# EAGLE design LWBoard (EAGLE 5.10)
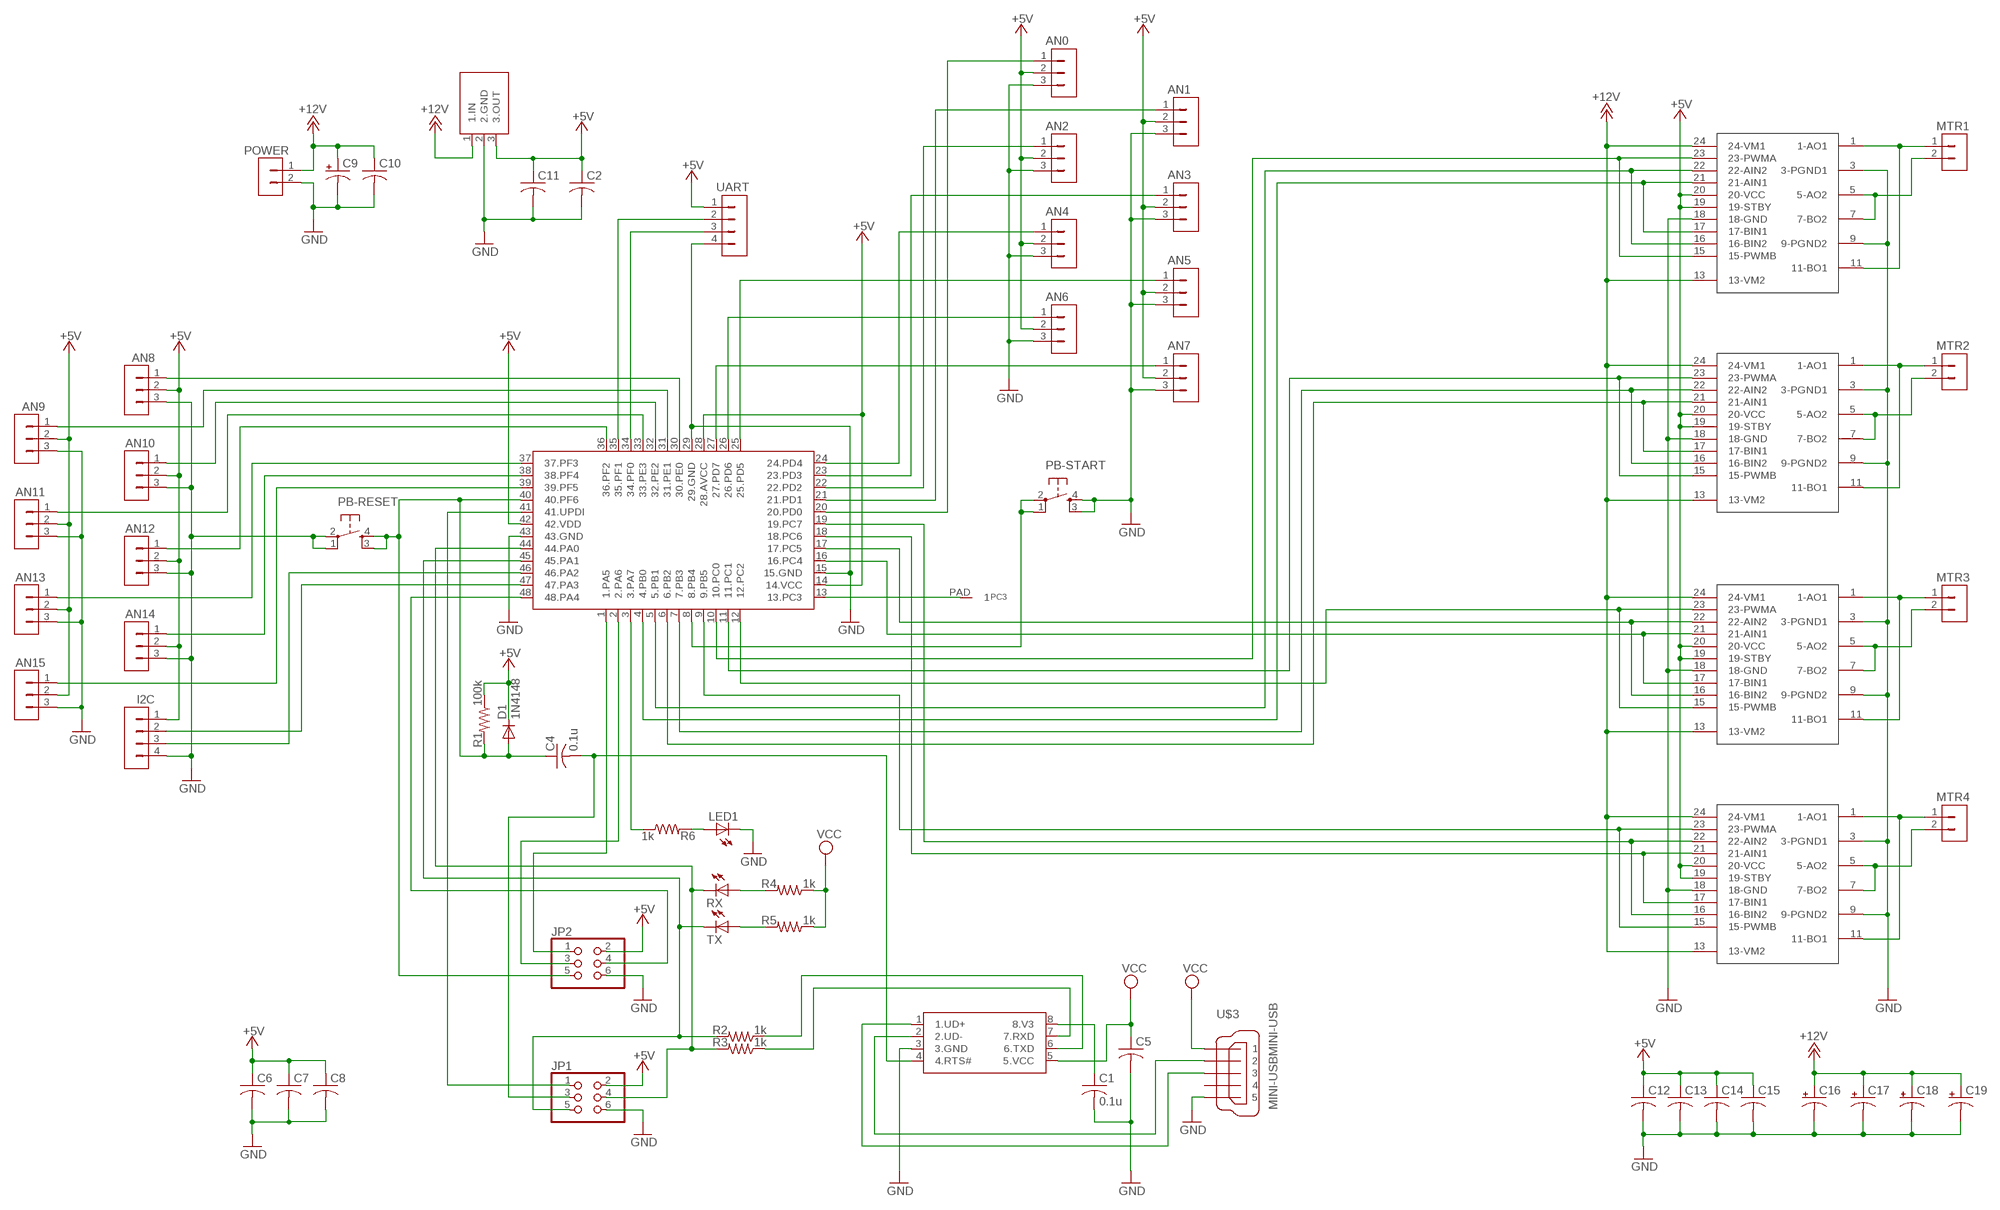
[diagram p0: schematic, sheet 1]

## Parts
AN0  XH3PDEFAULT  [XH3P]
AN1  XH3PDEFAULT  [XH3P]
AN2  XH3PDEFAULT  [XH3P]
AN3  XH3PDEFAULT  [XH3P]
AN4  XH3PDEFAULT  [XH3P]
AN5  XH3PDEFAULT  [XH3P]
AN6  XH3PDEFAULT  [XH3P]
AN7  XH3PDEFAULT  [XH3P]
AN8  XH3PDEFAULT  [XH3P]
AN9  XH3PDEFAULT  [XH3P]
AN10  XH3PDEFAULT  [XH3P]
AN11  XH3PDEFAULT  [XH3P]
AN12  XH3PDEFAULT  [XH3P]
AN13  XH3PDEFAULT  [XH3P]
AN14  XH3PDEFAULT  [XH3P]
AN15  XH3PDEFAULT  [XH3P]
C1  0.1u  C-USC0603  [C0603]
C2  C-USC1206  [C1206]
C4  0.1u  C-USC0603  [C0603]
C5  C-USC0603  [C0603]
C6  C-USC0603  [C0603]
C7  C-USC0603  [C0603]
C8  C-USC0603  [C0603]
C9  CPOL-USE5-10.5  [E5-10,5]
C10  C-USC0603  [C0603]
C11  C-USC0603  [C0603]
C12  C-USC0603  [C0603]
C13  C-USC0603  [C0603]
C14  C-USC0603  [C0603]
C15  C-USC0603  [C0603]
C16  CPOL-USE1.8-4  [E1,8-4]
C17  CPOL-USE1.8-4  [E1,8-4]
C18  CPOL-USE1.8-4  [E1,8-4]
C19  CPOL-USE1.8-4  [E1,8-4]
D1  1N4148  DIODE-SOD123  [SOD123]
I2C  XH4PDEFAULT  [XH4P]
IC1  MEGA4809  ATMEGA4809  [TQFP48]
IC5  TB6612FNG  TB6612-BB2  [TB6612-B2]
IC6  TB6612FNG  TB6612-BB2  [TB6612-B2]
IC7  TB6612FNG  TB6612-BB2  [TB6612-B2]
IC8  TB6612FNG  TB6612-BB2  [TB6612-B2]
JP1  PINHD-2X3  [2X03]
JP2  PINHD-2X3  [2X03]
LED1  LEDCHIP-LED0603  [CHIP-LED0603]
MTR1  XH2PDEFAULT  [XH2P]
MTR2  XH2PDEFAULT  [XH2P]
MTR3  XH2PDEFAULT  [XH2P]
MTR4  XH2PDEFAULT  [XH2P]
PB-RESET  TS20.2X0.35_IN  [TS2-SM2X3.5_IN]
PB-START  TS20.2X0.35_IN  [TS2-SM2X3.5_IN]
PC3  1-PIN0.9MM  [1-PIN_0.9MM]
POWER  XH2PDEFAULT  [XH2P]
R1  100k  R-US_R0603  [R0603]
R2  1k  R-US_R0603  [R0603]
R3  1k  R-US_R0603  [R0603]
R4  1k  R-US_R0603  [R0603]
R5  1k  R-US_R0603  [R0603]
R6  1k  R-US_R0603  [R0603]
RX  LEDCHIP-LED0603  [CHIP-LED0603]
TX  LEDCHIP-LED0603  [CHIP-LED0603]
U$2  CH340N  [SOP8]
U$3  MINI-USBMINI-USB  [MINI-USB]
U$4  NJM7800S  [TO252]
UART  XH4PDEFAULT  [XH4P]

## Nets
+5V: AN0.2 AN1.2 AN2.2 AN3.2 AN4.2 AN5.2 AN6.2 AN7.2 AN8.2 AN9.2 AN10.2 AN11.2 AN12.2 AN13.2 AN14.2 AN15.2 C2.1 C6.1 C7.1 C8.1 C11.1 C12.1 C13.1 C14.1 C15.1 D1.C I2C.1 IC1.14(14.VCC) IC1.28(28.AVCC) IC1.42(42.VDD) IC5.19(19-STBY) IC5.20(20-VCC) IC6.19(19-STBY) IC6.20(20-VCC) IC7.19(19-STBY) IC7.20(20-VCC) IC8.19(19-STBY) IC8.20(20-VCC) JP1.2 JP2.2 R1.1 U$4.3(3.OUT) UART.1
+12V: C9.+ C10.1 C16.+ C17.+ C18.+ C19.+ IC5.13(13-VM2) IC5.24(24-VM1) IC6.13(13-VM2) IC6.24(24-VM1) IC7.13(13-VM2) IC7.24(24-VM1) IC8.13(13-VM2) IC8.24(24-VM1) POWER.1 U$4.1(1.IN)
GND: AN0.3 AN1.3 AN2.3 AN3.3 AN4.3 AN5.3 AN6.3 AN7.3 AN8.3 AN9.3 AN10.3 AN11.3 AN12.3 AN13.3 AN14.3 AN15.3 C1.2 C2.2 C5.2 C6.2 C7.2 C8.2 C9.- C10.2 C11.2 C12.2 C13.2 C14.2 C15.2 C16.- C17.- C18.- C19.- I2C.4 IC1.15(15.GND) IC1.29(29.GND) IC1.43(43.GND) IC5.3(3-PGND1) IC5.9(9-PGND2) IC5.18(18-GND) IC6.3(3-PGND1) IC6.9(9-PGND2) IC6.18(18-GND) IC7.3(3-PGND1) IC7.9(9-PGND2) IC7.18(18-GND) IC8.3(3-PGND1) IC8.9(9-PGND2) IC8.18(18-GND) JP1.6 JP2.6 LED1.C PB-RESET.1 PB-RESET.2(P) PB-START.3(S1) PB-START.4(S) POWER.2 U$2.3(3.GND) U$3.5 U$4.2(2.GND) UART.4
N$1: C4.1 D1.A IC1.40(40.PF6) JP2.5 PB-RESET.3(S1) PB-RESET.4(S) R1.2
N$4: IC1.41(41.UPDI) JP1.1
N$5: AN0.1 IC1.20(20.PD0)
N$6: AN1.1 IC1.21(21.PD1)
N$7: R4.2 RX.A
N$8: R2.1 U$2.6(6.TXD)
N$9: R3.1 U$2.7(7.RXD)
N$10: IC1.45(45.PA1) JP1.5 R2.2 TX.C
N$11: IC1.44(44.PA0) JP1.4 R3.2 RX.C
N$12: C1.1 U$2.8(8.V3)
N$13: C4.2 JP1.3 U$2.4(4.RTS#)
N$14: R5.2 TX.A
N$15: U$2.2(2.UD-) U$3.2
N$16: U$2.1(1.UD+) U$3.3
N$17: AN2.1 IC1.22(22.PD2)
N$18: LED1.A R6.2
N$19: IC1.3(3.PA7) R6.1
N$20: AN3.1 IC1.23(23.PD3)
N$21: AN4.1 IC1.24(24.PD4)
N$22: AN5.1 IC1.25(25.PD5)
N$23: AN6.1 IC1.26(26.PD6)
N$24: AN7.1 IC1.27(27.PD7)
N$25: AN8.1 IC1.30(30.PE0)
N$26: AN9.1 IC1.31(31.PE1)
N$27: AN10.1 IC1.32(32.PE2)
N$28: AN11.1 IC1.33(33.PE3)
N$29: AN12.1 IC1.36(36.PF2)
N$30: AN13.1 IC1.37(37.PF3)
N$31: AN14.1 IC1.38(38.PF4)
N$32: IC1.13(13.PC3) PC3.PAD
N$33: IC1.4(4.PB0) IC5.17(17-BIN1) IC5.21(21-AIN1)
N$34: I2C.2 IC1.47(47.PA3)
N$35: I2C.3 IC1.46(46.PA2)
N$36: IC5.5(5-AO2) IC5.7(7-BO2) MTR1.2
N$38: IC5.1(1-AO1) IC5.11(11-BO1) MTR1.1
N$39: IC1.10(10.PC0) IC5.15(15-PWMB) IC5.23(23-PWMA)
N$40: IC1.5(5.PB1) IC5.16(16-BIN2) IC5.22(22-AIN2)
N$41: IC1.11(11.PC1) IC6.15(15-PWMB) IC6.23(23-PWMA)
N$42: IC1.7(7.PB3) IC6.16(16-BIN2) IC6.22(22-AIN2)
N$43: IC1.6(6.PB2) IC6.17(17-BIN1) IC6.21(21-AIN1)
N$45: AN15.1 IC1.39(39.PF5)
N$46: IC6.5(5-AO2) IC6.7(7-BO2) MTR2.2
N$47: IC1.8(8.PB4) PB-START.1 PB-START.2(P)
N$48: IC6.1(1-AO1) IC6.11(11-BO1) MTR2.1
N$49: IC1.12(12.PC2) IC7.15(15-PWMB) IC7.23(23-PWMA)
N$50: IC1.17(17.PC5) IC7.16(16-BIN2) IC7.22(22-AIN2)
N$51: IC1.16(16.PC4) IC7.17(17-BIN1) IC7.21(21-AIN1)
N$53: IC1.34(34.PF0) UART.3
N$54: IC7.5(5-AO2) IC7.7(7-BO2) MTR3.2
N$55: IC1.35(35.PF1) UART.2
N$56: IC7.1(1-AO1) IC7.11(11-BO1) MTR3.1
N$57: IC1.9(9.PB5) IC8.15(15-PWMB) IC8.23(23-PWMA)
N$58: IC1.19(19.PC7) IC8.16(16-BIN2) IC8.22(22-AIN2)
N$59: IC1.18(18.PC6) IC8.17(17-BIN1) IC8.21(21-AIN1)
N$62: IC8.5(5-AO2) IC8.7(7-BO2) MTR4.2
N$64: IC8.1(1-AO1) IC8.11(11-BO1) MTR4.1
N$65: IC1.48(48.PA4) JP2.4
N$66: IC1.1(1.PA5) JP2.1
N$67: IC1.2(2.PA6) JP2.3
VCC: C5.1 R4.1 R5.1 U$2.5(5.VCC) U$3.1
Unconnected: U$3.4

## Library data of the parts
AN0 AN1-AN15 = 0-User:XH3P
C1 C2 C4-C8 C10-C15 = rcl:C-US: CAPACITOR, American symbol
C9 C16-C19 = rcl:CPOL-US: POLARIZED CAPACITOR, American symbol
D1 = diode:DIODE-: DIODE
I2C UART = 0-User:XH4P
IC1 = 0-User:ATMEGA4809
IC5-IC8 = 1-MotorDriver:TB6612-B
JP1 JP2 = pinhead:PINHD-2X3: PIN HEADER
LED1 RX TX = led:LED: LED OSRAM: - CHIPLED LG R971, LG N971, LY N971, LG Q971, LY Q971, LO R971, LY R971 LH N974, LH R974 LS Q976, LO Q976, LY Q976 LO Q996 - Hyper CHIPLED LW Q18S LB Q993, LB Q99A, LB R99A - SideLED LS A670, LO A670, LY A670, LG A670, LP A670 LB A673, LV A673, LT A673, LW A673 LH A674 LY A675 LS A676, LA A676, LO A676, LY A676, LW A676 LS A679, LY A679, LG A679 - Hyper Micro SIDELED® LS Y876, LA Y876, LO Y876, LY Y876 LT Y87S - SmartLED LW L88C, LW L88S LB L89C, LB L89S, LG L890 LS L89K, LO L89K, LY L89K LS L896, LA L896, LO L896, LY L896 - TOPLED LS T670, LO T670, LY T670, LG T670, LP T670 LSG T670, LSP T670, LSY T670, LOP T670, LYG T670 LG T671, LOG T671, LSG T671 LB T673, LV T673, LT T673, LW T673 LH T674 LS T676, LA T676, LO T676, LY T676, LB T676, LH T676, LSB T676, LW T676 LB T67C, LV T67C, LT T67C, LS T67K, LO T67K, LY T67K, LW E67C LS E67B, LA E67B, LO E67B, LY E67B, LB E67C, LV E67C, LT E67C LW T67C LS T679, LY T679, LG T679 LS T770, LO T770, LY T770, LG T770, LP T770 LB T773, LV T773, LT T773, LW T773 LH T774 LS E675, LA E675, LY E675, LS T675 LS T776, LA T776, LO T776, LY T776, LB T776 LHGB T686 LT T68C, LB T68C - Hyper Mini TOPLED® LB M676 - Mini TOPLED Santana® LG M470 LS M47K, LO M47K, LY M47K Source: http://www.osram.convergy.de LUXEON: - LUMILED® LXK2-PW12-R00, LXK2-PW12-S00, LXK2-PW14-U00, LXK2-PW14-V00 LXK2-PM12-R00, LXK2-PM12-S00, LXK2-PM14-U00 LXK2-PE12-Q00, LXK2-PE12-R00, LXK2-PE12-S00, LXK2-PE14-T00, LXK2-PE14-U00 LXK2-PB12-K00, LXK2-PB12-L00, LXK2-PB12-M00, LXK2-PB14-N00, LXK2-PB14-P00, LXK2-PB14-Q00 LXK2-PR12-L00, LXK2-PR12-M00, LXK2-PR14-Q00, LXK2-PR14-R00 LXK2-PD12-Q00, LXK2-PD12-R00, LXK2-PD12-S00 LXK2-PH12-R00, LXK2-PH12-S00 LXK2-PL12-P00, LXK2-PL12-Q00, LXK2-PL12-R00 Source: www.luxeon.com KINGBRIGHT: KA-3528ASYC Source: www.kingbright.com
MTR1-MTR4 POWER = 0-User:XH2P
PB-RESET PB-START = 0-User:TS2
PC3 = 0-User:1-PIN
R1-R6 = rcl:R-US_: RESISTOR, American symbol
U$2 = 0-User:CH340N
U$3 = 0-User:MINI-USB
U$4 = 0-User:NJM7800S

## Board
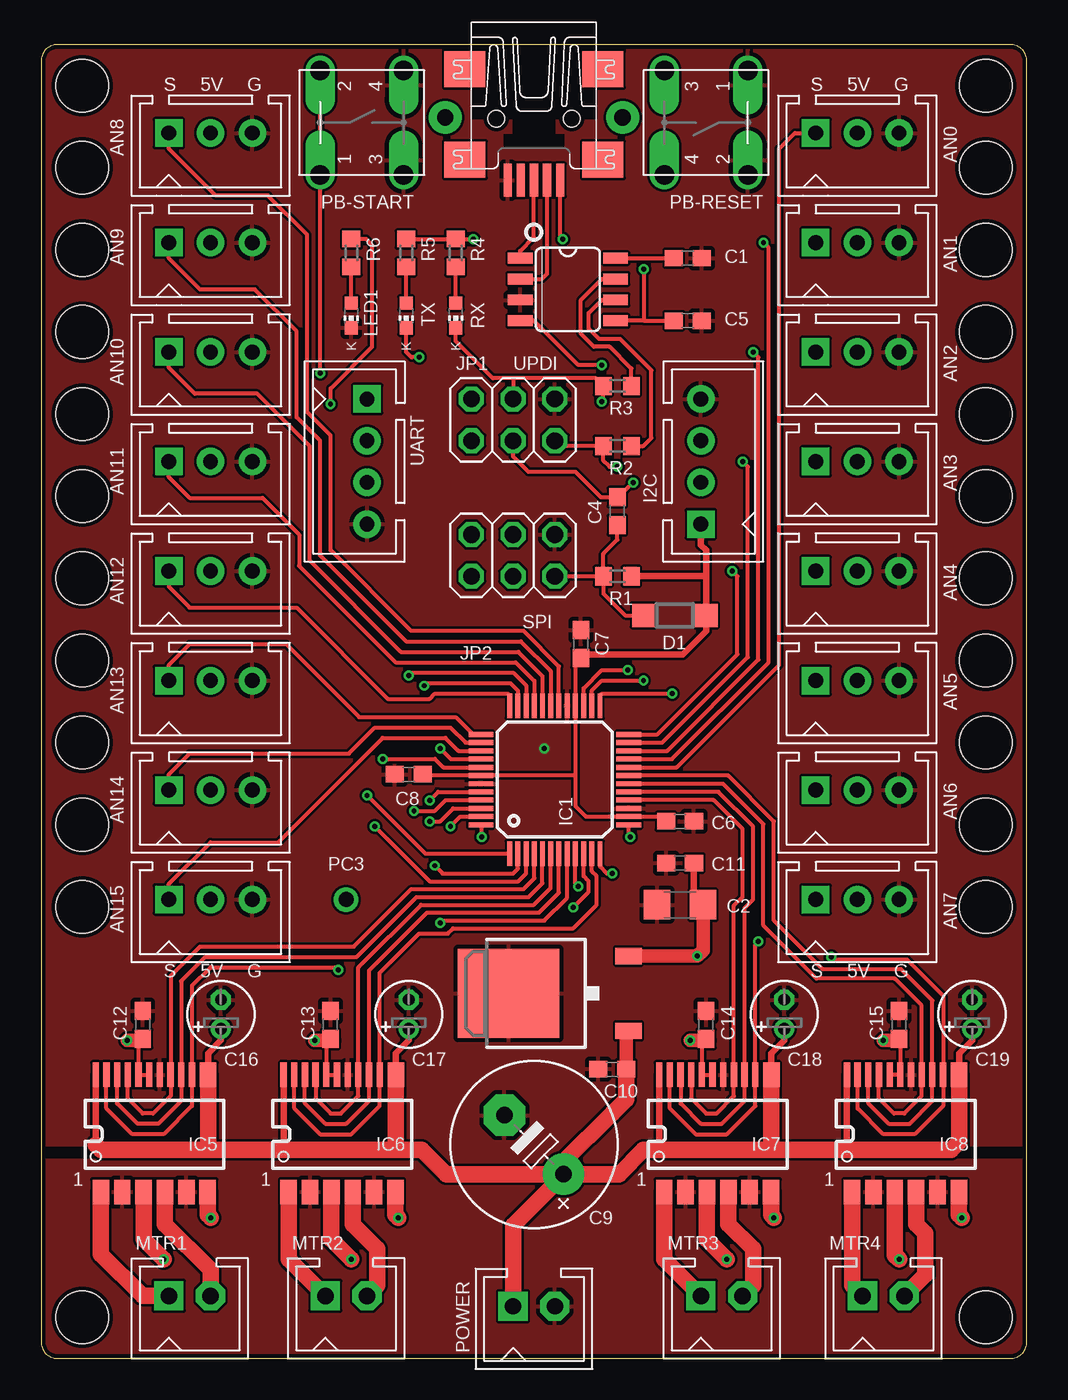
[diagram p1: board, top side]
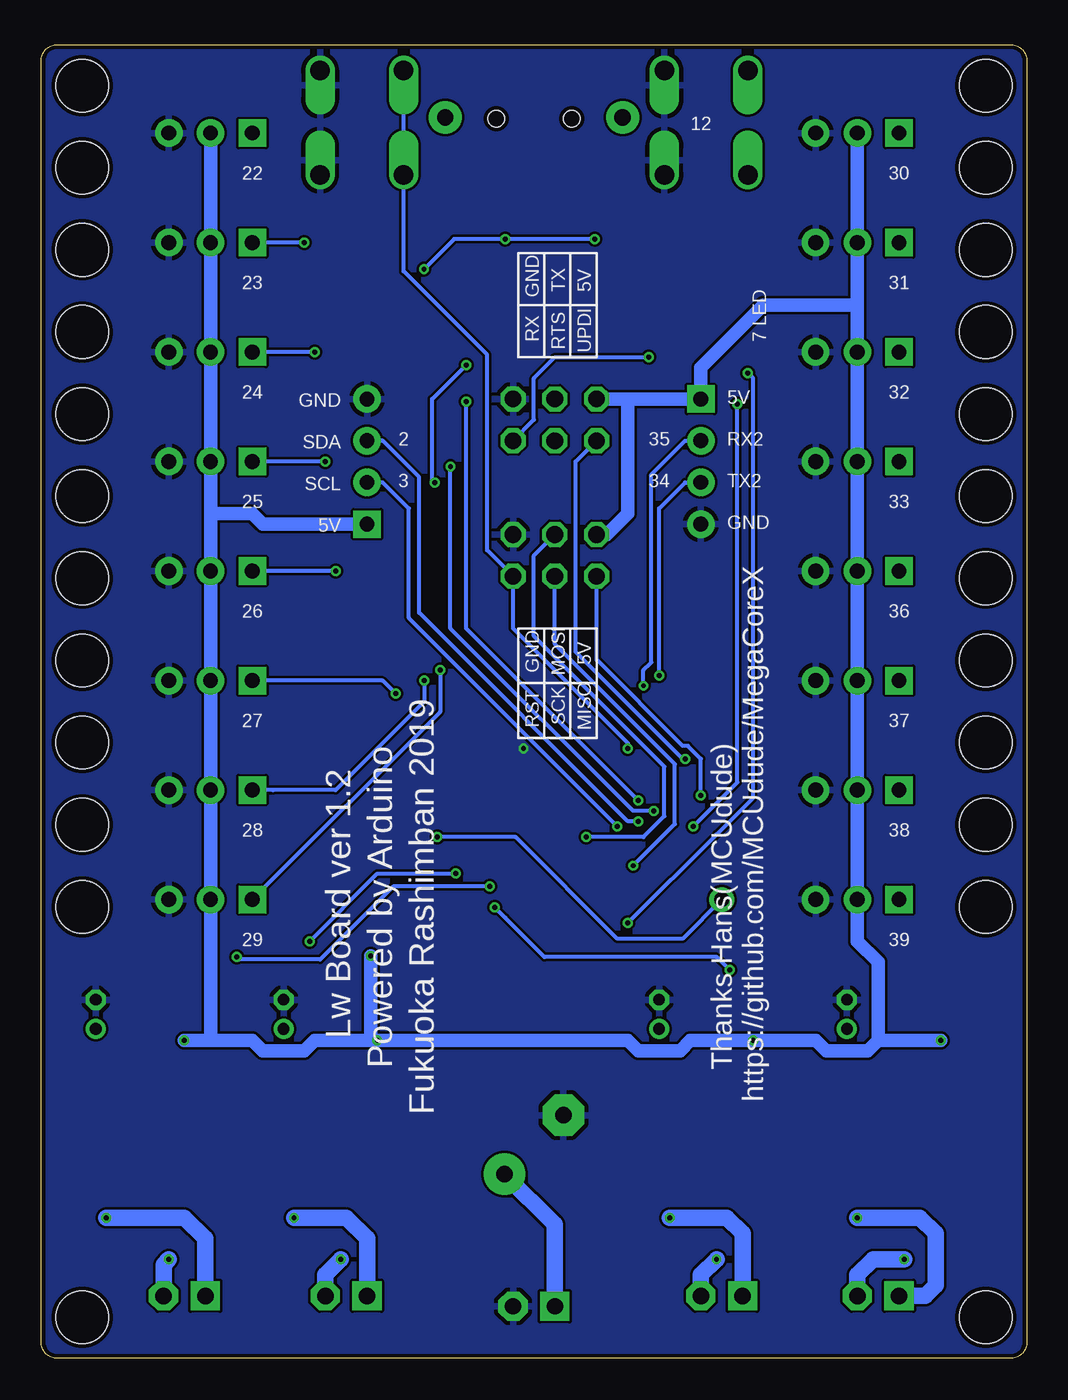
[diagram p2: board, bottom side, seen from below]

Size 60 x 80 mm. Coordinates in mm from the lower left corner, seen from the top.
Outline: 59,0 arc90 60,1 60,79 arc90 59,80 1,80 arc90 0,79 0,1 arc90 1,0 59,0
Copper layers (1*16): Top 0.035mm / dielectric 1.5mm / Bottom 0.035mm
Design rules "SeeedStudio_2layer_DRU_no_angle_20140221 *": minimum track width 6mil, minimum drill 11mil, track to track 6mil, track to pad 6mil, pad to pad 6mil, via to via 6mil, smd to smd 0mil, copper to edge 10mil, drill to drill 10mil, minimum pad ring 10mil, minimum via ring 6mil, stop-mask expansion 2mil, vias tented up to drill 100mil, thermal gap 10mil
Holes 3.2 mm at 2.5,77.5 2.5,72.5 2.5,67.5 2.5,62.5 2.5,57.5 2.5,52.5 2.5,47.5 2.5,42.5 2.5,37.5 2.5,32.5 2.5,27.5 2.5,2.5 57.5,77.5 57.5,72.5 57.5,67.5 57.5,62.5 57.5,57.5 57.5,52.5 57.5,47.5 57.5,42.5 57.5,37.5 57.5,32.5 57.5,27.5 57.5,2.5

### Footprints (pad centres in the part's own frame; a part is rotated, then mirrored left to right if it is on the bottom)
XH3P = drill 0.9 pad 1.676 square: 1 0,2.54 | drill 0.9 pad 1.676 round: 2 0,0; 3 0,-2.54
C0603 = smd 1.1 x 1: 1 -0.85,0; 2 0.85,0
C1206 = smd 1.6 x 1.8: 1 -1.4,0; 2 1.4,0
E5-10,5 = drill 1.016 pad 2.54 round: + -2.54,0 | drill 1.016 pad 2.54 octagon: - 2.54,0
E1,8-4 = drill 0.711 pad 1.168 round: + -0.889,0 | drill 0.711 pad 1.168 octagon: - 0.889,0
SOD123 = smd 1.4 x 1.4: A 1.9,0; C -1.9,0
XH4P = drill 0.9 pad 1.676 square: 1 0,0 | drill 0.9 pad 1.676 round: 2 0,2.54; 3 0,5.08; 4 0,7.62
TQFP48 = smd 1.5 x 0.3: 1 -4.5,2.75; 2 -4.5,2.25; 3 -4.5,1.75; 4 -4.5,1.25; 5 -4.5,0.75; 6 -4.5,0.25; 7 -4.5,-0.25; 8 -4.5,-0.75; 9 -4.5,-1.25; 10 -4.5,-1.75; 11 -4.5,-2.25; 12 -4.5,-2.75; 25 4.5,-2.75; 26 4.5,-2.25; 27 4.5,-1.75; 28 4.5,-1.25; 29 4.5,-0.75; 30 4.5,-0.25; 31 4.5,0.25; 32 4.5,0.75; 33 4.5,1.25; 34 4.5,1.75; 35 4.5,2.25; 36 4.5,2.75 | smd 0.3 x 1.5: 13 -2.75,-4.5; 14 -2.25,-4.5; 15 -1.75,-4.5; 16 -1.25,-4.5; 17 -0.75,-4.5; 18 -0.25,-4.5; 19 0.25,-4.5; 20 0.75,-4.5; 21 1.25,-4.5; 22 1.75,-4.5; 23 2.25,-4.5; 24 2.75,-4.5; 37 2.75,4.5; 38 2.25,4.5; 39 1.75,4.5; 40 1.25,4.5; 41 0.75,4.5; 42 0.25,4.5; 43 -0.25,4.5; 44 -0.75,4.5; 45 -1.25,4.5; 46 -1.75,4.5; 47 -2.25,4.5; 48 -2.75,4.5
TB6612-B2 = smd 1.5 x 1: 1 -3.838,3.498; 3 -3.838,2.197; 5 -3.838,0.897; 7 -3.838,-0.403; 9 -3.838,-1.702; 11 -3.838,-3.002; 13 3.305,-3.022 | smd 1.5 x 0.38: 15 3.305,-2.04; 16 3.305,-1.39; 17 3.305,-0.74; 18 3.305,-0.09; 19 3.305,0.56; 20 3.305,1.21; 21 3.305,1.86; 22 3.305,2.51; 23 3.305,3.16; 24 3.305,3.81
2X03 = drill 1.016 octagon: 1 -2.54,-1.27; 2 -2.54,1.27; 3 0,-1.27; 4 0,1.27; 5 2.54,-1.27; 6 2.54,1.27
CHIP-LED0603 = smd 0.8 x 0.8: A 0,-0.75; C 0,0.75
XH2P = drill 1 pad 1.778 square: 1 0,0 | drill 1 pad 1.778 octagon: 2 0,-2.54
TS2-SM2X3.5_IN = drill 1.194 offset: 1 -3.175,2.54; 2 3.175,2.54; 3 -3.175,-2.54; 4 3.175,-2.54
1-PIN_0.9MM = drill 0.9 pad 1.5 round: PAD 0,0
R0603 = smd 1 x 1.1: 1 -0.85,0; 2 0.85,0
SOP8 = smd 0.66 x 1.5: 1 1.27,-2.9; 2 2.54,-2.9; 3 3.81,-2.9; 4 5.08,-2.9; 5 5.08,2.9; 6 3.81,2.9; 7 2.54,2.9; 8 1.27,2.9
MINI-USB = smd 2 x 0.5: 1 3.25,1.6; 2 3.25,0.8; 3 3.25,0; 4 3.25,-0.8; 5 3.25,-1.6 | smd 2.2 x 2.5: M1 -3.5,-4.2; M2 -3.5,4.2; M3 2,4.2; M4 2,-4.2 | hole 1: -0.5,-2.3; -0.5,2.3
TO252 = smd 1 x 1.6: 1 -2.28,-6.07; 3 2.28,-6.07 | smd 5.4 x 6.2: 2 0,1.23

### Placement (x,y rotation side)
AN0  49.69,74.61 90 top
AN1  49.69,67.94 90 top
AN2  49.69,61.28 90 top
AN3  49.69,54.61 90 top
AN4  49.69,47.94 90 top
AN5  49.69,41.27 90 top
AN6  49.69,34.61 90 top
AN7  49.69,27.94 90 top
AN8  10.32,74.61 90 top
AN9  10.32,67.94 90 top
AN10  10.32,61.28 90 top
AN11  10.32,54.61 90 top
AN12  10.32,47.94 90 top
AN13  10.32,41.27 90 top
AN14  10.32,34.61 90 top
AN15  10.32,27.94 90 top
C1  39.37,66.99 0 top
C2  38.89,27.62 180 top
C4  35.08,51.59 90 top
C5  39.37,63.18 0 top
C6  38.89,32.7 0 top
C7  32.86,43.5 90 top
C8  22.38,35.56 180 top
C9  30,13.02 135 top
C10  34.76,17.62 180 top
C11  38.89,30.16 180 top
C12  6.19,20.32 90 top
C13  17.62,20.32 90 top
C14  40.48,20.32 90 top
C15  52.23,20.32 90 top
C16  10.95,20.95 90 top
C17  22.38,20.95 90 top
C18  45.24,20.95 90 top
C19  56.67,20.95 90 top
D1  38.57,45.24 180 top
I2C  40.16,50.8 0 top
IC1  31.27,35.24 90 top
IC5  7.14,13.97 90 top
IC6  18.57,13.97 90 top
IC7  41.43,13.97 90 top
IC8  52.86,13.97 90 top
JP1  28.73,57.15 0 top
JP2  28.73,48.9 0 top
LED1  18.89,63.5 180 top
MTR1  7.77,3.81 90 top
MTR2  17.3,3.81 90 top
MTR3  40.16,3.81 90 top
MTR4  50,3.81 90 top
PB-RESET  40.48,75.25 270 top
PB-START  19.52,75.25 90 top
PC3  18.57,27.94 0 top
POWER  28.73,3.17 90 top
R1  35.08,47.62 180 top
R2  35.08,55.56 180 top
R3  35.08,59.21 180 top
R4  25.24,67.31 270 top
R5  22.22,67.31 270 top
R6  18.89,67.31 270 top
RX  25.24,63.5 180 top
TX  22.22,63.5 180 top
U$2  32.06,68.26 270 top
U$3  30,74.99 270 top
U$4  29.68,22.23 90 top
UART  19.84,58.42 180 top

### Tracks (layer width: path | path; a pad name or v marks a point on that pad's centre or on a via)
+5V  (via drill 0.3)
  Top 0.254: IC5.19 IC5.20 5.93,19.21 C12.1 | C13.1 17.36,19.21 IC6.20 IC6.19 | C14.1 40.22,19.21 IC7.20 IC7.19 | C15.1 52.3,19.47 IC8.19 IC8.20 | 32.52,35.49 IC1.28 32.52,42.65 C7.1 33.07,42.86 | 32.52,35.49 IC1.42 22.98,35.49 C8.1 | C6.1 38.04,32.99 IC1.14 33.16,32.99 32.52,33.63 32.52,35.49 | C2.1 39.74,27.62
  Top 0.406: 39.74,27.62 C11.1 | 33.07,42.86 39.05,42.86 40.47,44.29 D1.C 40.47,47.62 | I2C.1 40.16,49.53 40.47,49.22 40.47,47.62 | 40.47,47.62 R1.1
  Top 0.813: C12.1 6.19,19.37 v5.23,19.37 | v51.27,19.37 52.01,19.37 C15.1 | C13.1 17.72,19.37 v16.66,19.37 | C14.1 40.58,19.37 v39.52,19.37 | U$4.3 39.63,24.5 v39.95,24.5 40.29,24.85 C2.1
  Bottom 0.254: 10.32,69.85 10.32,70.48
  Bottom 0.813: AN0.2 AN1.2 AN2.2 AN3.2 49.69,51.44 | 49.69,51.44 AN4.2 AN5.2 AN6.2 AN7.2 49.69,19.37 v51.27,19.37 47.14,19.37 46.51,18.73 43.97,18.73 43.34,19.37 39.95,19.37 | AN8.2 10.32,69.85 AN9.2 10.32,64.14 | 9.05,19.37 v5.23,19.37 | 9.05,19.37 9.68,18.73 12.22,18.73 12.86,19.37 v16.66,19.37 20.48,19.37 21.11,18.73 23.65,18.73 24.29,19.37 v39.52,19.37 | v39.52,19.37 39.84,19.37 | 39.95,19.37 v39.95,24.5 | v39.52,19.37 39.95,19.37 | I2C.1 46.51,50.8 47.14,51.44 49.69,51.44 | 9.05,19.37 9.05,24.13 10.32,25.4 AN15.2 AN14.2 AN13.2 AN12.2 AN11.2 AN10.2 10.32,64.14 | 24.44,58.42 UART.1 19.84,60.33 16.03,64.14 10.32,64.14 | 24.44,58.42 JP1.2 | JP2.2 25.55,50.16 24.29,51.44 24.29,58.26 24.44,58.42
+12V
  Top 0.406: 3.33,13.02 IC5.24 | 14.76,12.7 IC6.24 | 37.62,12.7 IC7.24 | 49.05,12.7 IC8.24 | IC8.13 55.88,18.58 56.67,19.37 C19.+ | IC7.13 44.45,18.58 45.24,19.37 C18.+ | IC6.13 21.59,18.58 22.38,19.37 C17.+ | IC5.13 10.16,18.58 10.95,19.37 C16.+
  Top 0.813: C10.1 35.61,17.78 35.61,19.95 U$4.1
  Top 1.016: 44.45,12.7 49.05,12.7 55.4,12.7 55.88,13.18 IC8.13 | 44.45,12.7 IC7.13 | 44.45,12.7 37.62,12.7 36.67,12.7 35.19,11.22 C9.+ | 21.59,12.7 IC6.13 | 21.59,12.7 23.17,12.7 24.65,11.22 C9.+ | IC5.13 10.16,12.7 | 10.16,12.7 14.76,12.7 21.59,12.7 | 3.33,13.02 3.65,12.7 10.16,12.7 | C10.1 35.61,15.77 34.76,14.92 31.8,11.96 C9.+ | POWER.1 28.73,8.1 31.75,11.11
  Bottom 1.016: POWER.1 28.73,8.15 C9.+
GND  (via drill 0.3)
  other vias: 30.64,37.15
  pour Top: 0,80 60,80 60,13.02 36.35,13.02 35.08,11.75 32.54,11.75 32.54,10.64 35.24,10.64 36.67,12.06 60,12.06 60,0 0,0 0,12.06 23.17,12.06 24.6,10.64 30,10.64 30,11.75 24.92,11.75 23.65,13.02 0,13.02
  pour Bottom: 0,80 60,80 60,0 0,0
N$1  (via drill 0.3)
  Top 0.254: JP2.5 R1.2 | IC1.40 24.94,36.49 v24.29,37.15 | R1.2 34.23,49 35.08,49.85 C4.1 | D1.A 35.56,45.24 34.23,46.57 R1.2
  Bottom 0.254: v24.29,37.15 24.29,37.47 31.27,44.45 JP2.5 32.86,49.21 32.86,61.12 37.94,66.2 PB-RESET.4 PB-RESET.3
N$2  (via drill 1 pad 2)
  other vias: 35.4,75.56
N$3  (via drill 1 pad 2)
  other vias: 24.6,75.56
N$4  (via drill 0.3)
  Top 0.254: IC1.41 24.49,35.99 23.97,36.51 v20.79,36.51
  Bottom 0.254: v20.79,36.51 20.95,36.51 27.46,43.02 27.46,54.61 JP1.1
N$5
  Top 0.254: AN0.1 45.88,74.61 44.92,73.66 44.92,42.23 38.69,35.99 IC1.20
N$6  (via drill 0.3)
  Top 0.254: v43.97,67.94 44.29,67.63 44.29,42.39 38.39,36.49 IC1.21
  Bottom 0.254: v43.97,67.94 AN1.1
N$7
  Top 0.254: RX.A R4.2
N$8
  Top 0.254: R2.1 36.67,55.56 37.14,56.04 37.14,60.17 35.24,62.07 33.97,62.07 33.33,62.71 33.33,63.66 34.13,64.45 U$2.6
N$9
  Top 0.254: 35.87,59.37 35.82,59.32 36.03,59.32 R3.1 35.93,60.27 34.6,61.59 33.65,61.59 32.86,62.39 32.86,64.45 34.13,65.72 U$2.7
N$10  (via drill 0.3)
  Top 0.254: JP1.5 31.59,55.56 R2.2 34.23,54.67 34.6,54.29 v35.08,54.29 | 22.58,60.96 v23.02,60.96 22.54,60.96 22.22,61.28 TX.C | IC1.45 24.62,33.99 23.97,33.34 v22.7,33.34
  Bottom 0.254: v23.02,60.96 28.73,60.96 30,59.69 30,57.15 JP1.5 | v22.7,33.34 23.97,33.34 35.08,44.45 v35.08,54.29
N$11  (via drill 0.3)
  Top 0.254: 28.73,59.69 32.06,59.69 33.75,59.69 R3.2 34.23,58.36 v34.13,58.26 | 28.73,59.69 27.5,59.69 25.24,61.96 RX.C | 28.73,59.69 JP1.4 | IC1.44 24.17,34.49 v23.65,33.97
  Bottom 0.254: v23.65,33.97 34.13,44.45 v34.13,58.26
N$12
  Top 0.254: U$2.8 C1.1
N$13  (via drill 0.3)
  Top 0.254: v36.03,53.34 35.61,52.92 C4.2 34.07,52.44 32.54,53.98 29.68,53.98 28.73,54.93 JP1.3 | v34.13,60.48 32.7,60.48 30,63.18 U$2.4
  Bottom 0.254: v36.03,53.34 36.19,53.5 36.19,58.42 v34.13,60.48
N$14
  Top 0.254: TX.A R5.2
N$15
  Top 0.254: U$3.2 30.8,66.05 30.48,65.72 U$2.2
N$16
  Top 0.254: U$3.3 30,68.26 29.16,67.43 U$2.1
N$17  (via drill 0.3)
  Top 0.254: v43.34,61.28 43.65,60.96 43.65,42.55 38.1,36.99 IC1.22
  Bottom 0.254: v43.34,61.28 AN2.1
N$18
  Top 0.254: LED1.A R6.2
N$19  (via drill 0.3)
  Top 0.254: v17.62,58.1 17.62,58.26 17.62,59.05 20.16,61.59 20.16,67.79 19.78,68.16 R6.1 | IC1.3 29.52,29.52 29.05,29.05 23.65,29.05 v20.32,32.38
  Bottom 0.254: v20.32,32.38 17.62,35.08 v17.62,58.1
N$20  (via drill 0.3)
  Top 0.254: v42.7,54.61 43.02,54.29 43.02,42.7 37.81,37.49 IC1.23
  Bottom 0.254: v42.7,54.61 AN3.1
N$21  (via drill 0.3)
  Top 0.254: v42.06,47.94 42.38,47.62 42.38,42.86 37.51,37.99 IC1.24
  Bottom 0.254: v42.06,47.94 AN4.1
N$22  (via drill 0.3)
  Top 0.254: IC1.25 34.02,40.37 34.13,40.48 v38.41,40.48
  Bottom 0.254: v38.41,40.48 39.21,41.27 AN5.1
N$23  (via drill 0.3)
  Top 0.254: IC1.26 33.52,40.67 34.13,41.27 v36.67,41.27
  Bottom 0.254: v36.67,41.27 36.67,40.01 42.06,34.61 45.88,34.61 AN6.1
N$24  (via drill 0.3)
  Top 0.254: IC1.27 33.02,40.8 34.13,41.91 v35.72,41.91
  Bottom 0.254: v35.72,41.91 35.72,39.37 AN7.1
N$25
  Top 0.254: AN8.1 7.77,73.66 10.63,70.8 13.81,70.8 16.19,68.42 16.19,57.63 17.62,56.2 17.62,49.21 22.54,44.29 29.36,44.29 31.52,42.14 IC1.30
N$26
  Top 0.254: AN9.1 7.77,66.99 9.68,65.09 13.01,65.09 15.55,62.55 15.55,57.31 16.98,55.88 16.98,48.9 22.22,43.66 29.21,43.66 31.02,41.84 IC1.31
N$27
  Top 0.254: AN10.1 7.77,60.33 9.36,58.74 13.17,58.74 16.35,55.56 16.35,48.58 21.9,43.02 29.05,43.02 30.52,41.55 IC1.32
N$28
  Top 0.254: AN11.1 7.77,53.66 9.05,52.39 13.49,52.39 15.71,50.16 15.71,48.26 21.59,42.39 28.89,42.39 30.02,41.26 IC1.33
N$29
  Top 0.254: AN12.1 7.77,46.99 9.05,45.72 15.55,45.72 21.11,40.16 23.65,40.16 23.97,40.48 28.41,40.48 28.52,40.37 IC1.36
N$30
  Top 0.254: AN13.1 7.77,42.23 9.05,43.5 14.92,43.5 19.36,39.05 25.24,39.05 26.3,37.99 IC1.37
N$31
  Top 0.254: AN14.1 7.77,35.56 9.05,36.83 18.73,36.83 20.32,38.42 24.92,38.42 25.84,37.49 IC1.38
N$32  (via drill 0.3)
  Top 0.254: IC1.13 35.77,31.85 arc90 v35.87,31.75
  Bottom 0.254: v35.87,31.75 31.11,31.75 24.92,25.56 20.95,25.56 PC3.PAD
N$33
  Top 0.254: IC5.21 5.28,15.83 6.19,14.92 6.82,14.92 7.88,15.98 IC5.17 7.88,23.28 9.68,25.08 19.05,25.08 22.54,28.57 29.36,28.57 30.02,29.23 IC1.4
N$34  (via drill 0.3)
  Top 0.254: v24.92,32.38 25.53,32.99 IC1.47
  Bottom 0.254: v24.92,32.38 37.62,45.09 37.62,51.75 39.21,53.34 I2C.2
N$35  (via drill 0.3)
  Top 0.254: IC1.46 25.08,33.49 24.29,32.7 v23.65,32.7
  Bottom 0.254: v23.65,32.7 24.29,32.7 36.98,45.4 36.98,53.66 39.21,55.88 I2C.3
N$36  (via drill 0.3)
  Top 1.016: IC5.7 7.54,8.17 10.32,5.4 MTR1.2 | IC5.5 6.24,7.25 v7.46,6.03
  Bottom 1.016: v7.46,6.03 9.36,6.03 10.32,5.08 MTR1.2
N$38  (via drill 0.3)
  Top 1.016: MTR1.1 6.19,3.81 3.64,6.36 IC5.1 | IC5.11 10.14,8.74 v10.32,8.57
  Bottom 1.016: v10.32,8.57 6.5,8.57 5.55,7.62 5.55,4.45 6.19,3.81 MTR1.1
N$39  (via drill 0.3)
  Top 0.254: IC5.23 3.98,15.22 5.55,13.65 7.46,13.65 9.18,15.38 IC5.15 9.18,22.68 10.32,23.81 17.94,23.81 v18.09,23.65 | IC1.10 33.02,29.36 33.33,29.05 33.33,28.42 v32.38,27.46
  Bottom 0.254: v18.09,23.65 18.89,24.45 29.36,24.45 31.75,26.83 v32.38,27.46
N$40
  Top 0.254: IC5.22 4.63,15.53 5.87,14.29 7.14,14.29 8.53,15.68 IC5.16 8.53,22.98 10,24.45 19.2,24.45 22.86,28.1 29.68,28.1 30.52,28.94 IC1.5
N$41
  Top 0.254: IC6.23 15.41,15.22 16.98,13.65 18.89,13.65 20.61,15.38 IC6.15 20.61,23.47 23.02,25.88 24.76,25.88 25.08,26.19 32.38,26.19 33.81,27.62 33.81,29.37 33.52,29.66 IC1.11
N$42
  Top 0.254: IC6.22 16.06,15.53 17.3,14.29 18.57,14.29 19.96,15.68 IC6.16 19.96,23.61 23.49,27.15 30.32,27.15 31.52,28.35 IC1.7
N$43
  Top 0.254: IC6.21 16.71,15.83 17.62,14.92 18.25,14.92 19.31,15.98 IC6.17 19.31,23.8 23.14,27.62 30,27.62 31.02,28.64 IC1.6
N$45
  Top 0.254: AN15.1 7.77,28.89 10.32,31.43 14.44,31.43 20.79,37.78 24.6,37.78 25.39,36.99 IC1.39
N$46  (via drill 0.3)
  Top 1.016: IC6.7 18.97,8.17 20.48,6.67 20.48,4.45 MTR2.2 | IC6.5 17.67,7.25 v18.89,6.03
  Bottom 1.016: v18.89,6.03 19.84,5.08 MTR2.2
N$47  (via drill 0.3)
  Top 0.254: IC1.8 32.02,28.05 30.64,26.67 24.44,26.67 v24.29,26.51 | v16.98,60.01 | v16.98,60.01 PB-START.1 PB-START.2
  Bottom 0.254: v24.29,26.51 | v24.29,26.51 18.89,31.91 16.66,34.13 16.66,59.69 v16.98,60.01
N$48  (via drill 0.3)
  Top 1.016: IC6.1 15.07,6.04 MTR2.1 | IC6.11 21.57,8.74 v21.74,8.57
  Bottom 1.016: v21.74,8.57 18.25,8.57 17.3,7.62 MTR2.1
N$49  (via drill 0.3)
  Top 0.254: IC7.23 38.27,15.22 39.84,13.65 41.75,13.65 43.47,15.38 IC7.15 43.47,25.22 v43.65,25.4 | IC1.12 34.02,29.95 34.45,29.53 v34.76,29.53
  Bottom 0.254: v43.65,25.4 39.52,29.53 v34.76,29.53
N$50
  Top 0.254: IC7.22 38.92,15.53 40.16,14.29 41.43,14.29 42.82,15.68 IC7.16 42.82,27.43 43.34,27.94 43.34,32.38 41.23,34.49 IC1.17
N$51
  Top 0.254: IC7.21 39.57,15.83 40.48,14.92 41.11,14.92 42.17,15.98 IC7.17 42.17,27.57 42.7,28.1 42.7,32.23 40.93,33.99 IC1.16
N$53  (via drill 0.3)
  Top 0.254: IC1.34 29.52,40.96 28.73,41.75 22.7,41.75 22.54,41.75 v22.38,41.59
  Bottom 0.254: v22.38,41.59 22.38,51.75 20.79,53.34 UART.3
N$54  (via drill 0.3)
  Top 1.016: IC7.7 41.83,8.17 43.34,6.67 43.34,4.45 MTR3.2 | IC7.5 40.53,7.25 v41.75,6.03
  Bottom 1.016: v41.75,6.03 42.7,5.08 MTR3.2
N$55  (via drill 0.3)
  Top 0.254: IC1.35 29.02,40.67 28.57,41.12 23.49,41.12 v23.33,40.96
  Bottom 0.254: v23.33,40.96 23.33,41.91 22.86,42.39 22.86,53.34 22.86,53.82 20.79,55.88 20.32,55.88 UART.2
N$56  (via drill 0.3)
  Top 1.016: IC7.1 37.93,6.04 MTR3.1 | IC7.11 44.43,8.74 v44.61,8.57
  Bottom 1.016: v44.61,8.57 41.43,8.57 40.16,7.3 MTR3.1
N$57  (via drill 0.3)
  Top 0.254: IC8.23 49.7,15.22 51.27,13.65 53.18,13.65 54.9,15.38 IC8.15 54.9,22.09 52.7,24.29 48.26,24.29 v48.1,24.45 | IC1.9 32.52,28.91 v32.7,28.73
  Bottom 0.254: v32.7,28.73 32.86,28.73 38.57,28.73 43.02,24.29 47.94,24.29 v48.1,24.45
N$58
  Top 0.254: IC8.22 50.35,15.53 51.59,14.29 52.86,14.29 54.25,15.68 IC8.16 54.25,21.79 52.34,23.69 47.58,23.69 44.61,26.67 44.61,32.7 41.81,35.49 IC1.19
N$59
  Top 0.254: IC8.21 51,15.83 51.91,14.92 52.54,14.92 53.6,15.98 IC8.17 53.6,21.48 51.95,23.13 47.19,23.13 43.97,26.35 43.97,32.54 41.52,34.99 IC1.18
N$62  (via drill 0.3)
  Top 1.016: IC8.7 53.26,8.17 53.81,7.62 53.81,5.08 MTR4.2 | IC8.5 51.96,6.29 v52.23,6.03
  Bottom 1.016: v52.23,6.03 52.54,5.71 MTR4.2
N$64  (via drill 0.3)
  Top 1.016: IC8.1 49.36,4.45 MTR4.1 | IC8.11 55.86,8.74 v56.03,8.57
  Bottom 1.016: v56.03,8.57 51.27,8.57 50,7.3 MTR4.1
N$65  (via drill 0.3)
  Top 0.254: IC1.48 26.82,32.44 v26.82,31.75
  Bottom 0.254: v26.82,31.75 23.33,31.75 22.06,33.02 22.06,36.04 30,43.97 30,48.9 JP2.4
N$66  (via drill 0.3)
  Top 0.254: IC1.1 23.39,30.74 v19.84,34.29
  Bottom 0.254: v19.84,34.29 19.84,36.51 20.63,37.31 20.95,37.31 26.19,42.55 JP2.1
N$67  (via drill 0.3)
  Top 0.254: IC1.2 29.02,29.82 28.73,29.53 24.44,29.53 v23.97,30
  Bottom 0.254: v23.97,30 21.43,32.54 21.43,36.2 28.73,43.5 JP2.3
VCC  (via drill 0.3)
  Top 0.254: R5.1 R4.1 v26.29,68.16 | U$3.1 31.6,68.41 31.75,68.26 v31.75,68.16 | 36.69,63.18 C5.1 | v36.69,66.33 36.69,63.18 | 36.69,63.18 U$2.5
  Bottom 0.254: v26.29,68.16 v31.75,68.16 34.87,68.16 v36.69,66.33

### Text on the board
tPlace: S | 5V | G | S | 5V | G | K | K | K | UPDI | SPI | S | 5V | G | S | 5V | G
bPlace: 12 | 30 | 22 | 31 | 7 LED | 5V | TX | GND | 23 | RX | UPDI | RTS | GND | 32 | 5V | 24 | RX2 | 35 | 2 | SDA | SCL | TX2 | 34 | 3 | 33 | 25 | 5V | GND | https://github.com/MCUdude/MegaCoreX | 36 | 26 | 5V | MOSI | GND | Fukuoka Rashimban 2019 | SCK | 37 | MISO | RST | 27 | Thanks Hans(MCUdude) | Powered by Arduino | Lw Board ver 1.2 | 38 | 28 | 39 | 29